# EAGLE schematic audio2 (EAGLE 7.7.0)
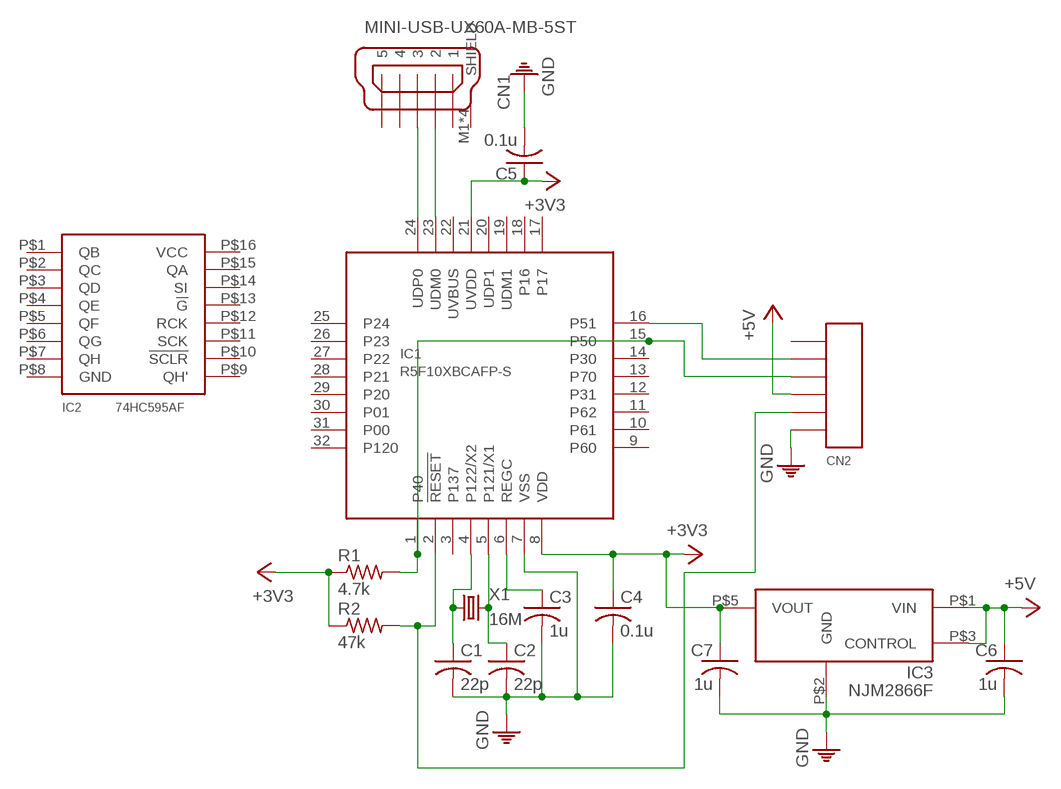
[diagram p0: schematic, sheet 1]

## Parts
C1  22p  C1608  [C1608]
C2  22p  C1608  [C1608]
C3  1u  C2012  [C2012]
C4  0.1u  C2012  [C2012]
C5  0.1u  C2012  [C2012]
C6  1u  C2012  [C2012]
C7  1u  C2012  [C2012]
CN1  MINI-USB-UX60A-MB-5ST  [UX60A-MB-5ST]
CN2  PH-1X06RG  [PH-1X06RG]
IC1  R5F10XBCAFP-S  [P-LQFP32-7X7-0.80S]
IC2  74HC595AF  [SOP16-P-300-1.27A]
IC3  NJM2866F  [SOT-23-5]
R1  4.7k  R2012  [R2012]
R2  47k  R2012  [R2012]
X1  16M  CRYSTAL_FA-238V  [FA-238V]

## Nets
+3V3: C4.1 C5.1 C7.1 IC1.8(VDD) IC1.21(UVDD) IC3.P$5(VOUT) R1.1 R2.1
+5V: C6.1 CN2.P$4 IC3.P$1(VIN) IC3.P$3(CONTROL)
GND: C1.2 C2.2 C3.2 C4.2 C5.2 C6.2 C7.2 CN2.P$6 IC1.7(VSS) IC3.P$2(GND)
N$1: CN1.3 IC1.24(UDP0)
N$2: CN1.2 IC1.23(UDM0)
N$3: C1.1 IC1.4(P122/X2) X1.1
N$4: C2.1 IC1.5(P121/X1) X1.3
N$7: C3.1 IC1.6(REGC)
N$9: CN2.P$3 IC1.1(P40) IC1.15(P50) R1.2
N$10: CN2.P$2 IC1.16(P51)
N$11: CN2.P$5 IC1.2(!RESET!) R2.2
Unconnected: CN1.1 CN1.4 CN1.5 CN1.M1(SHIELD) CN1.M2(SHIELD) CN1.M3(SHIELD) CN1.M4(SHIELD) CN2.P$1 IC1.3(P137) IC1.9(P60) IC1.10(P61) IC1.11(P62) IC1.12(P31) IC1.13(P70) IC1.14(P30) IC1.17 IC1.18(P16) IC1.19(UDM1) IC1.20(UDP1) IC1.22(UVBUS) IC1.25(P24) IC1.26(P23) IC1.27(P22) IC1.28(P21) IC1.29(P20) IC1.30(P01) IC1.31(P00) IC1.32(P120) IC2.P$1(QB) IC2.P$2(QC) IC2.P$3(QD) IC2.P$4(QE) IC2.P$5(QF) IC2.P$6(QG) IC2.P$7(QH) IC2.P$9(QH') IC2.P$10(!SCLR!) IC2.P$11(SCK) IC2.P$12(RCK) IC2.P$13(!G!) IC2.P$14(SI) IC2.P$15(QA)

## Power pins joined to a net without a drawn wire
GND: IC2.P$8(GND)
VCC: IC2.P$16(VCC)

## Library data of the parts
C1-C7 = MyLib:C: CAPACITOR, American symbol
CN1 = MyLib:MINI-USB-: MINI USB Connector Source: http://www.hirose.co.jp/cataloge_hp/e24000019.pdf
CN2 = MyLib:PH-1X06
IC1 = MyLib:R5F10XBC*FP
IC2 = MyLib:74*595
IC3 = MyLib:NJM2866F
R1 R2 = MyLib:R: RESISTOR, American symbol
X1 = MyLib:CRYSTAL_: CRYSTAL